# Altium schematic sheet Arduino NG Ahuratus-SCH.SchDoc
size A; Organization: Altium Limited; Address1: L3, 12a Rodborough Rd; Address2: Frenchs Forest; Address3: NSW; Address4: Australia 2086
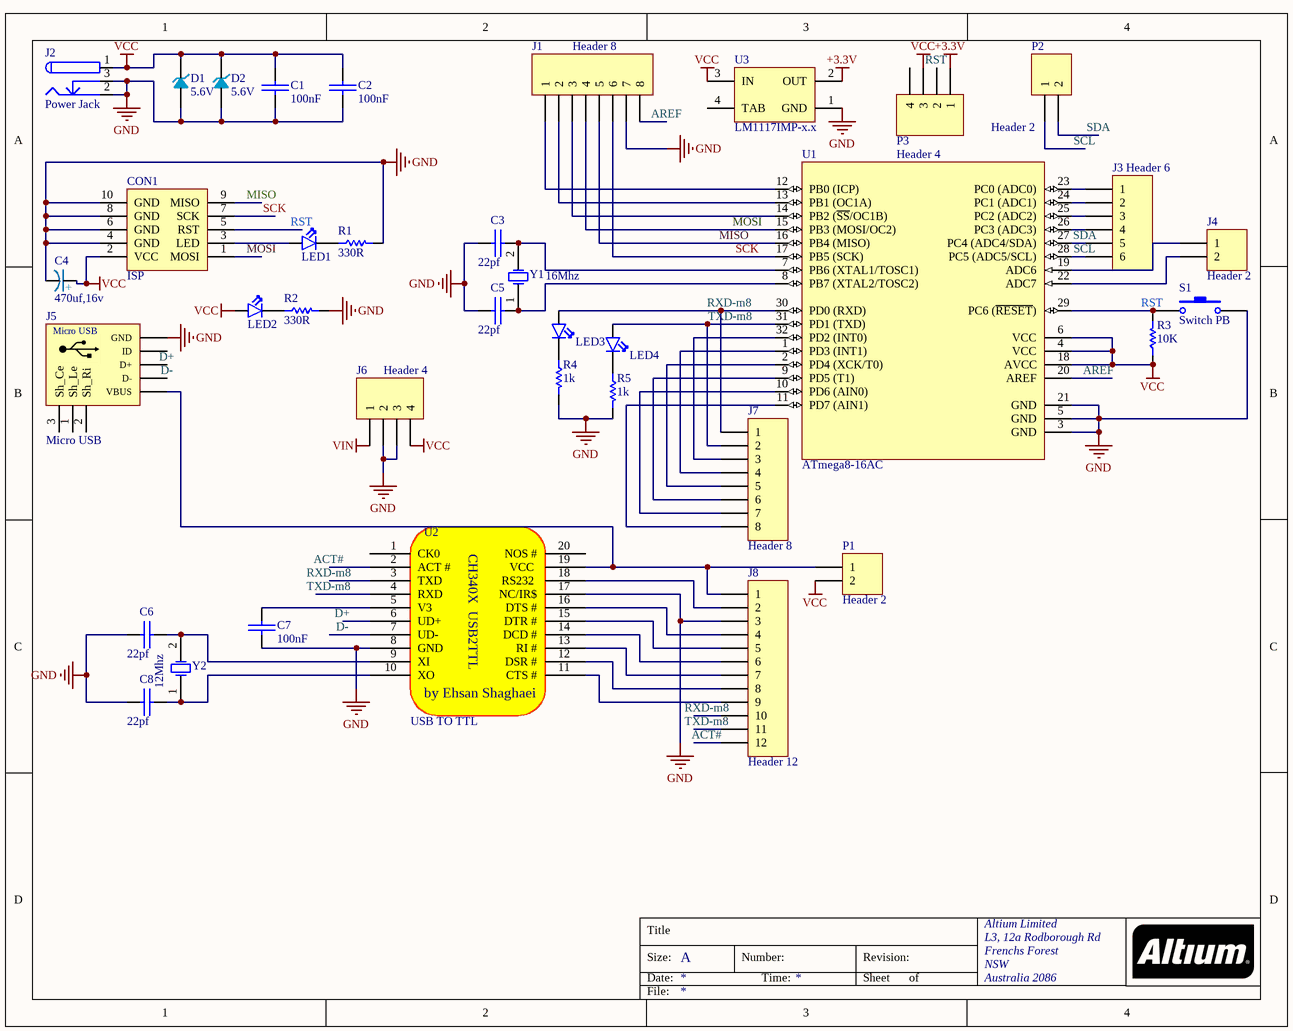
[diagram p0: Arduino NG Ahuratus-SCH.SchDoc]

## Parts
C1  100nF  [SMD_CAP_0805]
C2  100nF  [SMD_CAP_0805]
C3  22pf  [SMD_CAP_0603]
C4  Description:: 470uf,16v  [Electrolytic Capacitor SMD Dia-8 - 100uf]  (hidden comment: Capacitor Polarized)
C5  22pf  [SMD_CAP_0603]
C6  22pf  [SMD_CAP_0603]
C7  100nF  [SMD_CAP_0805]
C8  22pf  [SMD_CAP_0603]
CON1  ISP  [IDC2_5]
D1  5.6V  [DIOMELF3615N]
D2  5.6V  [DIOMELF3615N]
J1  Header 8  [HDR1X8]
J2  Power Jack  [Power Jack]
J3  Header 6  [HDR1X6]
J4  Header 2  [HDR1X2]
J5  Micro USB  [MicroUSB]
J6  Header 4  [HDR1X4]
J7  Header 8  [HDR1X8]
J8  Header 12  [HDR1X12]
LED1  LED  [LED0805]  (value not drawn)
LED2  LED  [LED0805]  (value not drawn)
LED3  LED  [LED0805]  (value not drawn)
LED4  LED  [LED0805]  (value not drawn)
P1  Header 2  [HDR1X2]
P2  Header 2  [HDR1X2]
P3  Header 4  [HDR1X4]
R1  330R  [RES 0603 (1608X06L)]
R2  330R  [RES 0603 (1608X06L)]
R3  10K  [RES 0603 (1608X06L)]
R4  1k  [RES 0603 (1608X06L)]
R5  1k  [RES 0603 (1608X06L)]
S1  Switch PB  [SW-PB]
U1  ATmega8-16AC  [32A_L]
U2  USB TO TTL  [CH340T]
U3  LM1117IMP-x.x  [MP04A_L]
Y1  16Mhz  [Crystal SMD]
Y2  12Mhz  [Crystal SMD]

## Nets
+3.3V: P3.1 U3.2(OUT)
GND: C1.2(-) C2.2(-) C3.1(+) C4.2 C5.1(+) C6.1(+) C7.2(-) C8.1(+) CON1.4(GND) CON1.6(GND) CON1.8(GND) CON1.10(GND) D1.2 D2.2 J1.7 J2.2 J2.3 J5.5-GND(GND) J6.2 J6.3 J8.3 R1.2 R2.2 R4.2 R5.2 S1.2 U1.3(GND) U1.5(GND) U1.21(GND) U2.8(GND) U2.17(NC/IR$) U3.1(GND)
VCC: C1.1(+) C2.1(+) C4.1 CON1.2(VCC) D1.1 D2.1 J2.1 J6.4 LED2.1(A) P1.2 P3.3 R3.1 U1.4(VCC) U1.6(VCC) U1.18(AVCC) U3.3(IN)
VIN: J6.1
ACT#: J8.12 U2.2(ACT_#)
AREF: J1.8 U1.20(AREF)
D+: J5.3-D+(D+) U2.6(UD+)
D-: J5.2-D-(D-) U2.7(UD-)
MISO: CON1.9(MISO) J1.5 U1.16(PB4_(MISO))
MOSI: CON1.1(MOSI) J1.4 U1.15(PB3_(MOSI/OC2))
RST: CON1.5(RST) P3.2 R3.2 S1.1 U1.29(PC6_(~{RESET}))
RXD-m8: J7.1 J8.10 LED3.1(A) U1.30(PD0_(RXD)) U2.3(TXD)
SCK: CON1.7(SCK) J1.6 U1.17(PB5_(SCK))
SCL: J3.6 P2.1 U1.28(PC5_(ADC5/SCL))
SDA: J3.5 P2.2 U1.27(PC4_(ADC4/SDA))
TXD-m8: J7.2 J8.11 LED4.1(A) U1.31(PD1_(TXD)) U2.4(RXD)
NetC3_2: C3.2(-) U1.7(PB6_(XTAL1/TOSC1)) Y1.2(OSC2)
NetC5_2: C5.2(-) U1.8(PB7_(XTAL2/TOSC2)) Y1.1(OSC1)
NetC6_2: C6.2(-) U2.9(XI) Y2.2(OSC2)
NetC7_1: C7.1(+) U2.5(V3)
NetC8_2: C8.2(-) U2.10(XO) Y2.1(OSC1)
NetCON1_3: CON1.3(LED) LED1.1(A)
NetJ1_1: J1.1 U1.12(PB0_(ICP))
NetJ1_2: J1.2 U1.13(PB1_(OC1A))
NetJ1_3: J1.3 U1.14(PB2_(~{SS}/OC1B))
NetJ3_1: J3.1 U1.23(PC0_(ADC0))
NetJ3_2: J3.2 U1.24(PC1_(ADC1))
NetJ3_3: J3.3 U1.25(PC2_(ADC2))
NetJ3_4: J3.4 U1.26(PC3_(ADC3))
NetJ4_1: J4.1 U1.19(ADC6)
NetJ4_2: J4.2 U1.22(ADC7)
NetJ5_1-VBUS: J5.1-VBUS(VBUS) J8.1 P1.1 U2.19(VCC)
NetJ7_3: J7.3 U1.32(PD2_(INT0))
NetJ7_4: J7.4 U1.1(PD3_(INT1))
NetJ7_5: J7.5 U1.2(PD4_(XCK/T0))
NetJ7_6: J7.6 U1.9(PD5_(T1))
NetJ7_7: J7.7 U1.10(PD6_(AIN0))
NetJ7_8: J7.8 U1.11(PD7_(AIN1))
NetJ8_2: J8.2 U2.18(RS232)
NetJ8_4: J8.4 U2.16(DTS_#)
NetJ8_5: J8.5 U2.15(DTR_#)
NetJ8_6: J8.6 U2.14(DCD_#)
NetJ8_7: J8.7 U2.13(RI_#)
NetJ8_8: J8.8 U2.12(DSR_#)
NetJ8_9: J8.9 U2.11(CTS_#)
NetLED1_2: LED1.2(K) R1.1
NetLED2_2: LED2.2(K) R2.1
NetLED3_2: LED3.2(K) R4.1
NetLED4_2: LED4.2(K) R5.1

Not connected (* = marked no-connect by the designer): J5 1(Sh_Le) 2(Sh_Ri) 3(Sh_Ce) 4-ID(ID); P3 4; U2 1(CK0) 20(NOS_#); U3 4(TAB)

## Notes on the sheet
- Title
- Size:
- Date:
- A
- Number:
- Time:
- Revision:
- Sheet
- of
- File:
- (in symbol Capacitor Polarized) +
- (in symbol CH340T) CH340X  USB2TTL; by Ehsan Shaghaei

## Library data of the parts
C1-C3 C5-C8 = Cap-Bipolar: Bipolar Capacitor; Voltage: 100V; Designer: Saeid Jorablo; Organazation: ControTec; Adding Date: 1387/12/20
  C1 C2 C7: Value: 100nF
  C3 C5 C6 C8: Value: 22pf
C4 = Capacitor Polarized: Designer: Hamed Jafarzadeh ( R2T )
D1 D2 = Diode Zener SMD: Designer: Hamed Jafarzadeh
J1 J7 = Header 8: Header, 8-Pin; LatestRevisionDate: 17-Jul-2002; LatestRevisionNote: Re-released for DXP Platform.; Publisher: Altium Limited
J2 = Power Jack: Designer: Saeid Jorablo; Company: Personal; Project Name: Laser; Adding Date: 10/21/2009
J3 = Header 6: Header, 6-Pin; LatestRevisionDate: 17-Jul-2002; LatestRevisionNote: Re-released for DXP Platform.; Publisher: Altium Limited
J4 P1 P2 = Header 2: Header, 2-Pin; LatestRevisionDate: 17-Jul-2002; LatestRevisionNote: Re-released for DXP Platform.; Publisher: Altium Limited
J5 = USB Micro: ENG: Ehsan Shaghaei
J6 P3 = Header 4: Header, 4-Pin; LatestRevisionDate: 17-Jul-2002; LatestRevisionNote: Re-released for DXP Platform.; Publisher: Altium Limited
J8 = Header 12: Header, 12-Pin; LatestRevisionDate: 17-Jul-2002; LatestRevisionNote: Re-released for DXP Platform.; Publisher: Altium Limited
LED1-LED4 = LED: Designer :: Razi Research Team Of Mashhad - Hamed Jafarzadeh
R1-R5 = Resistor
  R1 R2: Value: 330R
  R3: Value: 10K
  R4 R5: Value: 1k
S1 = Switch PB: Push Button Switch
U1 = ATmega8-16AC: 8-Bit AVR Microcontroller with 8K Bytes of In-System Programmable Flash Memory; Published: 17-Sep-2003; LatestRevisionDate: 13-Apr-2006; LatestRevisionNote: IPC-7351 Footprint Added.; DatasheetVersion: 2486H-AVR-09/02; PackageVersion: revB, Oct-2001; PackageReference: 32A; Publisher: Altium Limited; PackageDescription: 32-Pin Thin Quad Flat Pack 0.8 mm Pitch; Code_JEDEC: MS-026-ABA; ComponentLink1Description: Manufacturer Link; ComponentLink1URL: http://www.atmel.com; ComponentLink2Description: Datasheet; ComponentLink2URL: http://www.atmel.com/dyn/resources/prod_documents/doc2486.pdf
U2 = CH340T: Designer: Ehsan Shaghaei; Web site: www.dregg.com
U3 = LM1117IMP-x.x: x.x Volt, 800mA Low-Dropout Linear Regulator, 4-pin SOT-223; PartNumber: LM1117IMP-3.3; Manufacturer: National Semiconductor; PackageTopMarking: XYTT*N05B; PowerWise: N; CompType: LDO IC; Published: 4-Dec-2008; DatasheetVersion: Apr-2006; PackageVersion: revB, Apr-2003; PackageReference: MP04A; Publisher: Altium Limited; PackageDescription: Molded SOT-223, 6.50 x 3.56 x 1.6mm Body, 4 Lead, 2.3mm Pitch; Supplier 1: Farnell; Supplier Part Number 1: 7614123; RoHS: N; PinCount: 4; Code_JEDEC: TO-261-AA; Code_IPC: SOT223-4; ComponentLink1Description: LM1117 Datasheet; ComponentLink1URL: http://www.national.com/ds/LM/LM1117.pdf; ComponentLink2Description: LM1117 Web Page; ComponentLink2URL: http://www.national.com/pf/LM/LM1117.html; ComponentLink3Description: MP04A Package Page; ComponentLink3URL: http://www.national.com/packaging/folders/mp04a.html
Y1 Y2 = XTAL: XTAL Crystal; Company: E.P.I.L; Design Date: 11/04/2011
  Y1: Value: 16Mhz
  Y2: Value: 12Mhz